# EAGLE design tdt_cableTester (EAGLE 8.1.0)

## Sheet 1 of 4
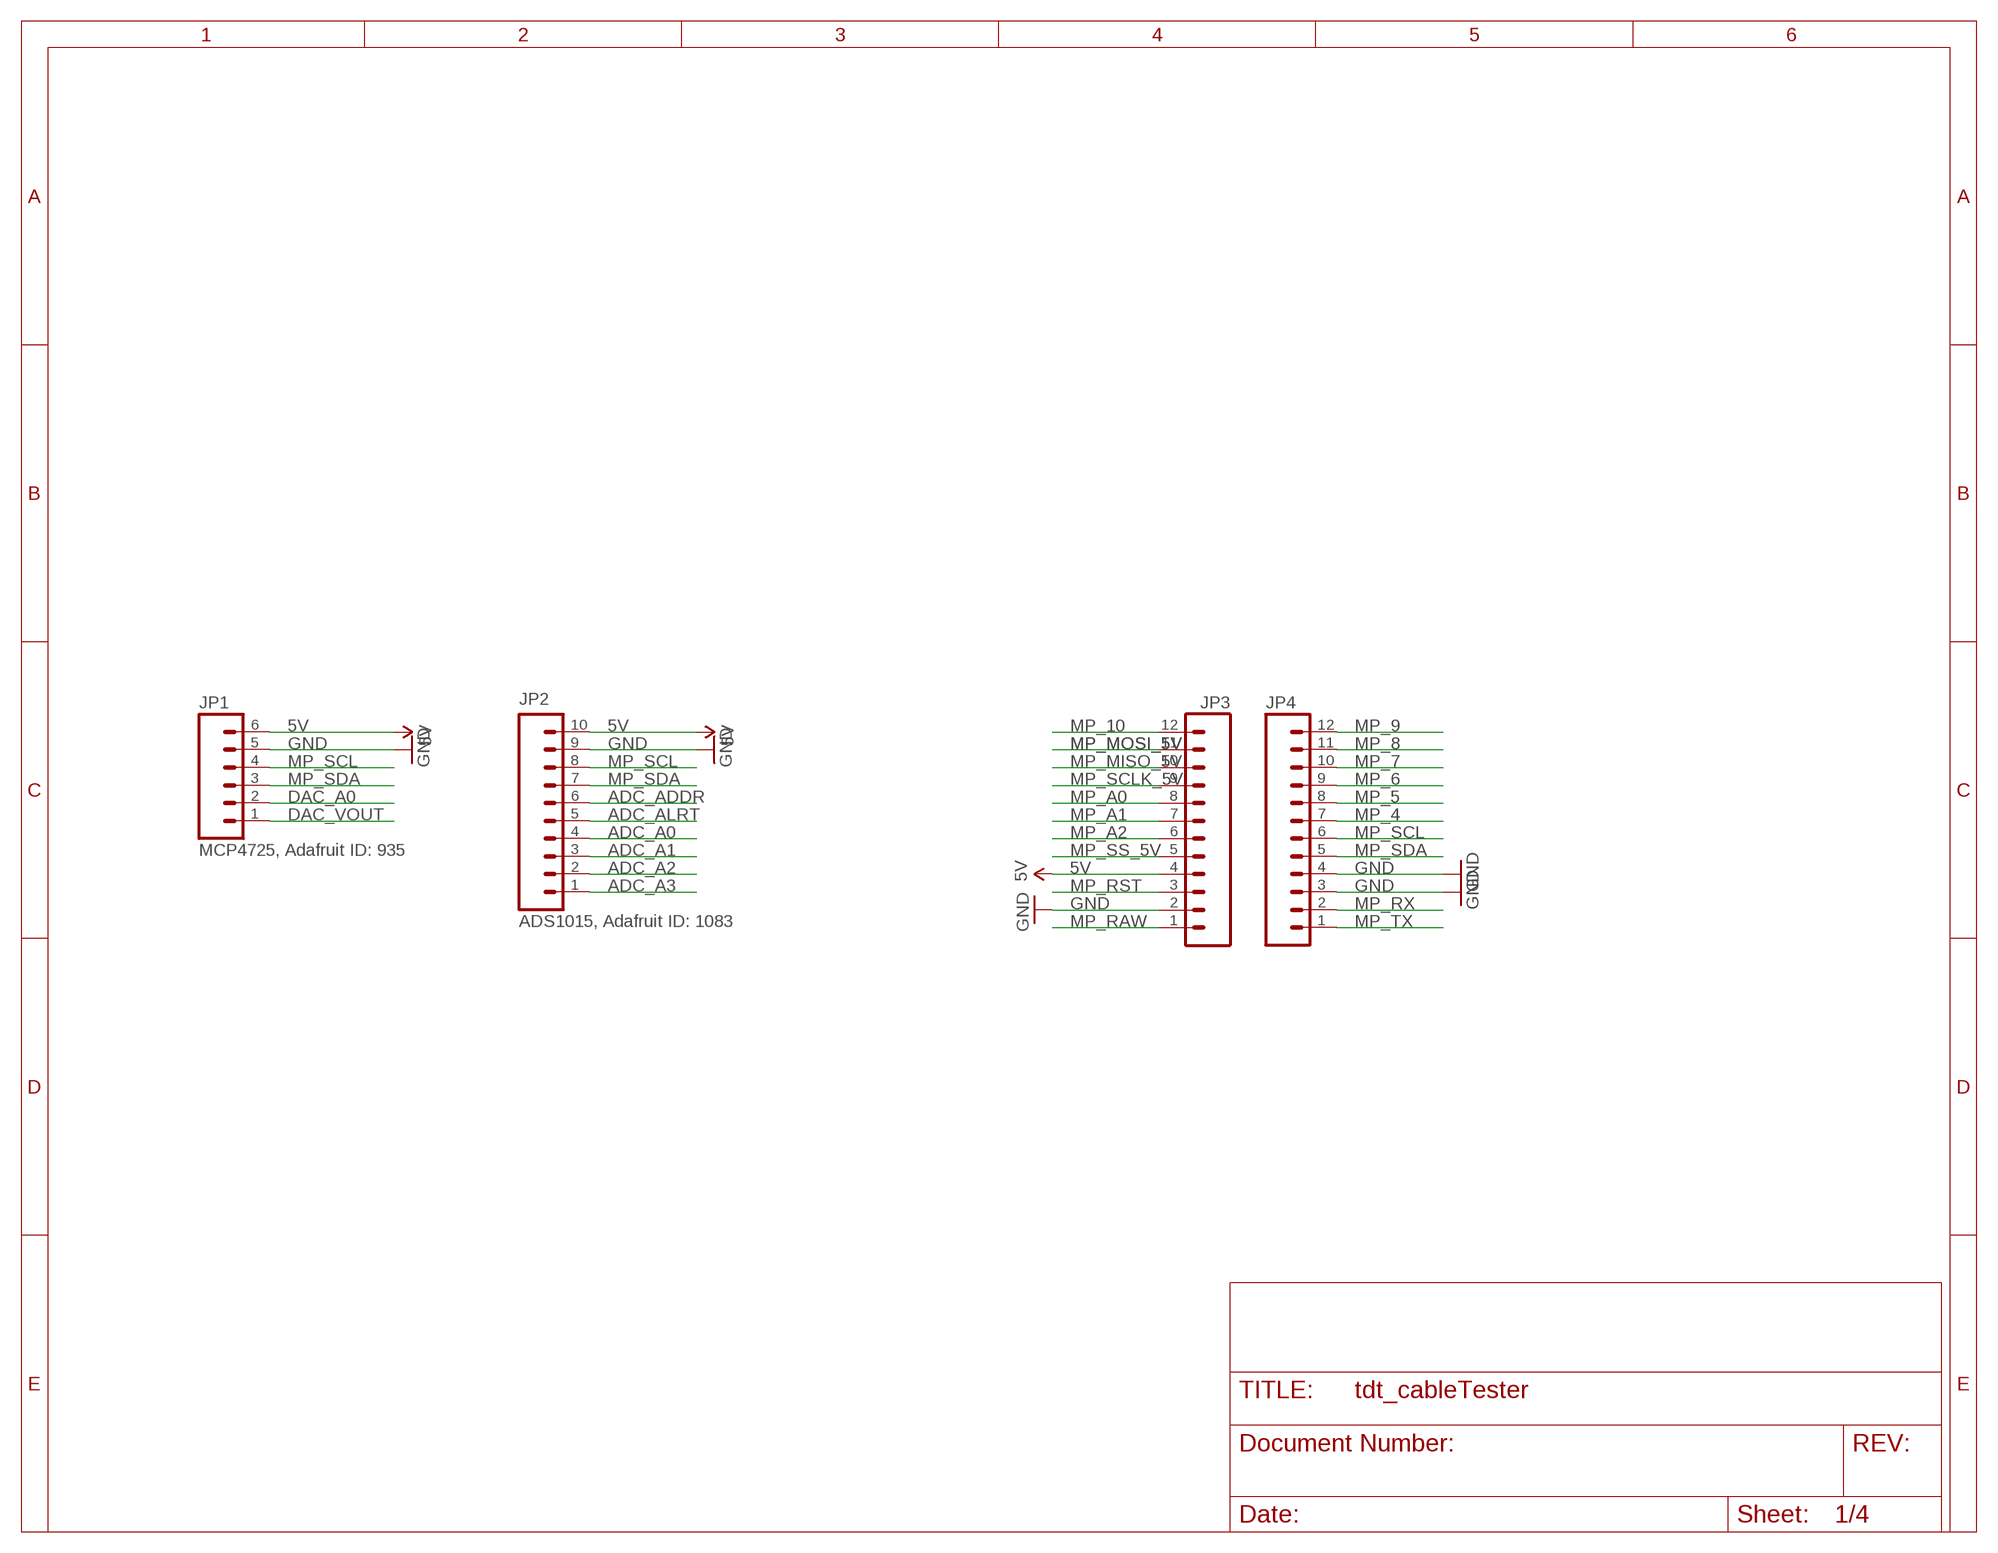
[diagram p0: schematic, sheet 1]

### Parts
JP1  MCP4725, Adafruit ID: 935  M06SILK_FEMALE_PTH  [1X06]
JP2  ADS1015, Adafruit ID: 1083  M10SILK_FEMALE_PTH  [1X10]
JP3  M12PTH  [1X12]
JP4  M12PTH  [1X12]

### Nets
5V: JP1.6 JP2.10 JP3.4 ; also sheet 2,3,4
ADC_A0: JP2.4
ADC_A1: JP2.3 ; also sheet 3
ADC_A2: JP2.2 ; also sheet 3
ADC_A3: JP2.1 ; also sheet 3
ADC_ADDR: JP2.6
ADC_ALRT: JP2.5
DAC_A0: JP1.2
DAC_VOUT: JP1.1 ; also sheet 4
GND: JP1.5 JP2.9 JP3.2 JP4.3 JP4.4 ; also sheet 2,3,4
MP_4: JP4.7 ; also sheet 3
MP_5: JP4.8 ; also sheet 3
MP_6: JP4.9 ; also sheet 3
MP_7: JP4.10 ; also sheet 3
MP_8: JP4.11 ; also sheet 4
MP_9: JP4.12 ; also sheet 4
MP_10: JP3.12 ; also sheet 4
MP_A0: JP3.8 ; also sheet 4
MP_A1: JP3.7 ; also sheet 4
MP_A2: JP3.6 ; also sheet 4
MP_MISO_5V: JP3.10 ; also sheet 2
MP_MOSI_5V: JP3.11 ; also sheet 2
MP_RAW: JP3.1
MP_RST: JP3.3
MP_RX: JP4.2
MP_SCL: JP1.4 JP2.8 JP4.6
MP_SCLK_5V: JP3.9 ; also sheet 2
MP_SDA: JP1.3 JP2.7 JP4.5
MP_SS_5V: JP3.5 ; also sheet 2
MP_TX: JP4.1

## Sheet 2 of 4
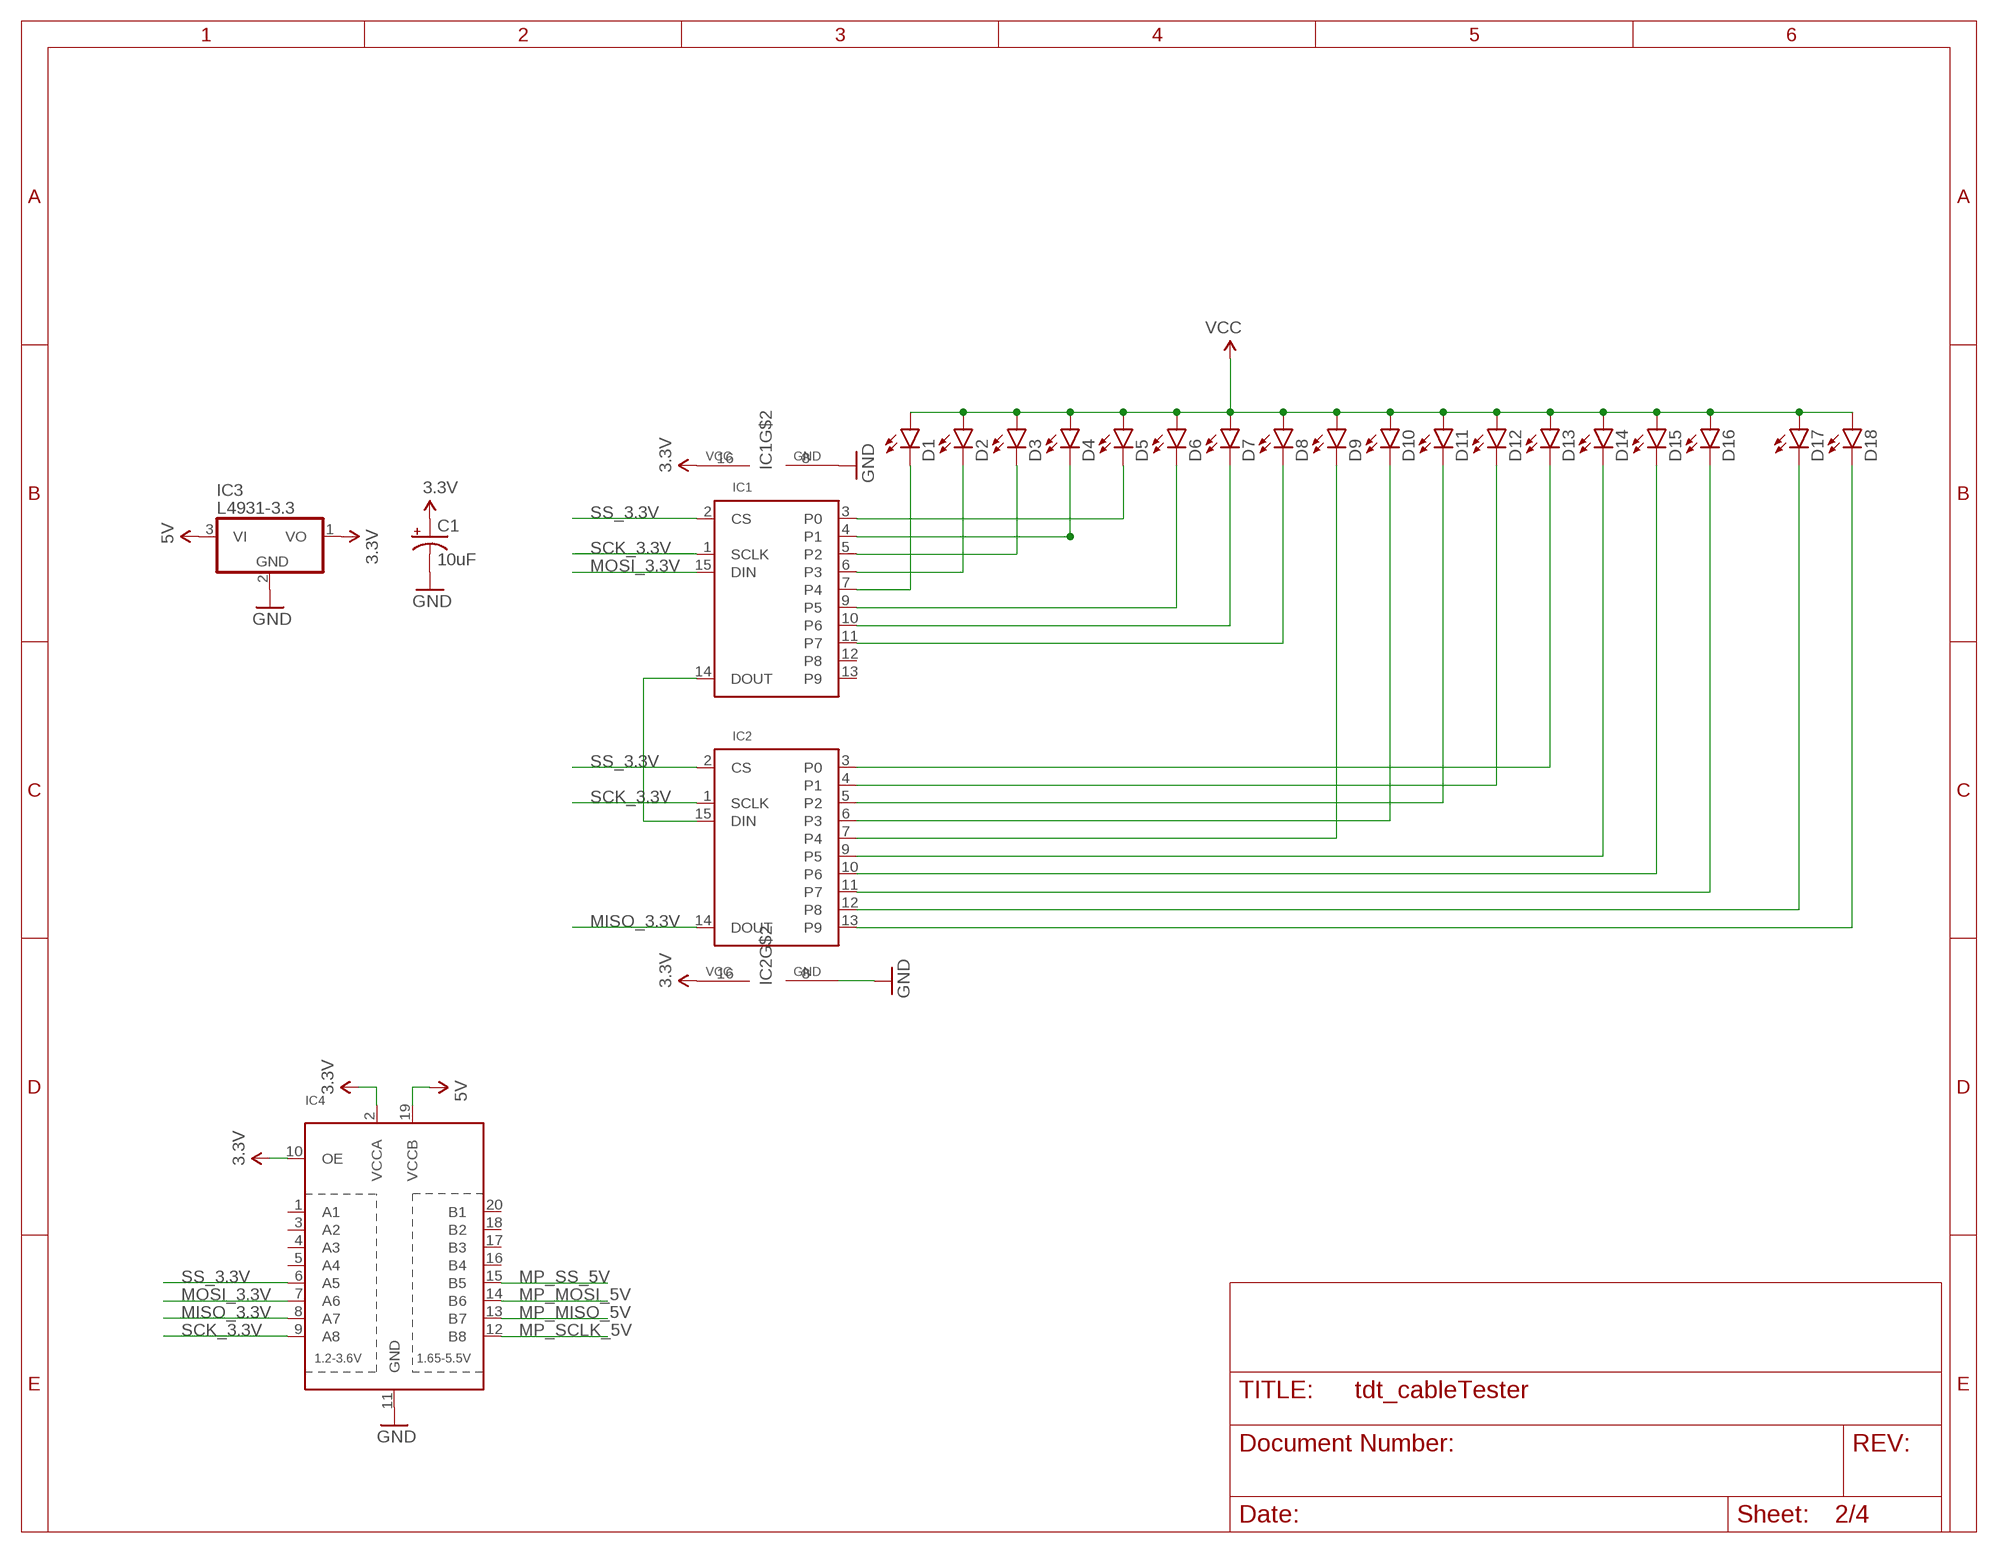
[diagram p1: schematic, sheet 2]

### Parts
C1  10uF  CAP_POLPTH2  [CPOL-RADIAL-10UF-25V]
D1  LED1206  [LED-1206]
D2  LED1206  [LED-1206]
D3  LED1206  [LED-1206]
D4  LED1206  [LED-1206]
D5  LED1206  [LED-1206]
D6  LED1206  [LED-1206]
D7  LED1206  [LED-1206]
D8  LED1206  [LED-1206]
D9  LED1206  [LED-1206]
D10  LED1206  [LED-1206]
D11  LED1206  [LED-1206]
D12  LED1206  [LED-1206]
D13  LED1206  [LED-1206]
D14  LED1206  [LED-1206]
D15  LED1206  [LED-1206]
D16  LED1206  [LED-1206]
D17  LED1206  [LED-1206]
D18  LED1206  [LED-1206]
IC1  MAX6966AEE  [QSOP16]
IC2  MAX6966AEE  [QSOP16]
IC3  L4931-3.3  78L05Z  [TO92]
IC4  TXB0108PWR  [TSSOP20]

### Nets
3.3V: C1.1(+) IC1.16(VCC) IC2.16(VCC) IC3.1(VO) IC4.2(VCCA) IC4.10(OE)
5V: IC3.3(VI) IC4.19(VCCB) ; also sheet 1,3,4
DOUT_3.3V: IC1.14(DOUT) IC2.15(DIN)
GND: C1.2(-) IC1.8(GND) IC2.8(GND) IC3.2(GND) IC4.11(GND) ; also sheet 1,3,4
MISO_3.3V: IC2.14(DOUT) IC4.8(A7)
MOSI_3.3V: IC1.15(DIN) IC4.7(A6)
MP_MISO_5V: IC4.13(B7) ; also sheet 1
MP_MOSI_5V: IC4.14(B6) ; also sheet 1
MP_SCLK_5V: IC4.12(B8) ; also sheet 1
MP_SS_5V: IC4.15(B5) ; also sheet 1
N$1: D9.C IC2.7(P4)
N$2: D10.C IC2.6(P3)
N$3: D11.C IC2.5(P2)
N$5: D12.C IC2.4(P1)
N$6: D13.C IC2.3(P0)
N$7: D14.C IC2.9(P5)
N$9: D5.C IC1.3(P0)
N$11: D3.C IC1.5(P2)
N$12: D2.C IC1.6(P3)
N$13: D1.C IC1.7(P4)
N$14: D6.C IC1.9(P5)
N$15: D7.C IC1.10(P6)
N$16: D8.C IC1.11(P7)
N$19: D4.C IC1.4(P1)
N$23: D16.C IC2.11(P7)
N$25: D18.C IC2.13(P9)
N$27: D15.C IC2.10(P6)
N$29: D17.C IC2.12(P8)
SCK_3.3V: IC1.1(SCLK) IC2.1(SCLK) IC4.9(A8)
SS_3.3V: IC1.2(CS) IC2.2(CS) IC4.6(A5)
VCC: D1.A D2.A D3.A D4.A D5.A D6.A D7.A D8.A D9.A D10.A D11.A D12.A D13.A D14.A D15.A D16.A D17.A D18.A
Unconnected: IC1.12(P8) IC1.13(P9) IC4.1(A1) IC4.3(A2) IC4.4(A3) IC4.5(A4) IC4.16(B4) IC4.17(B3) IC4.18(B2) IC4.20(B1)

## Sheet 3 of 4
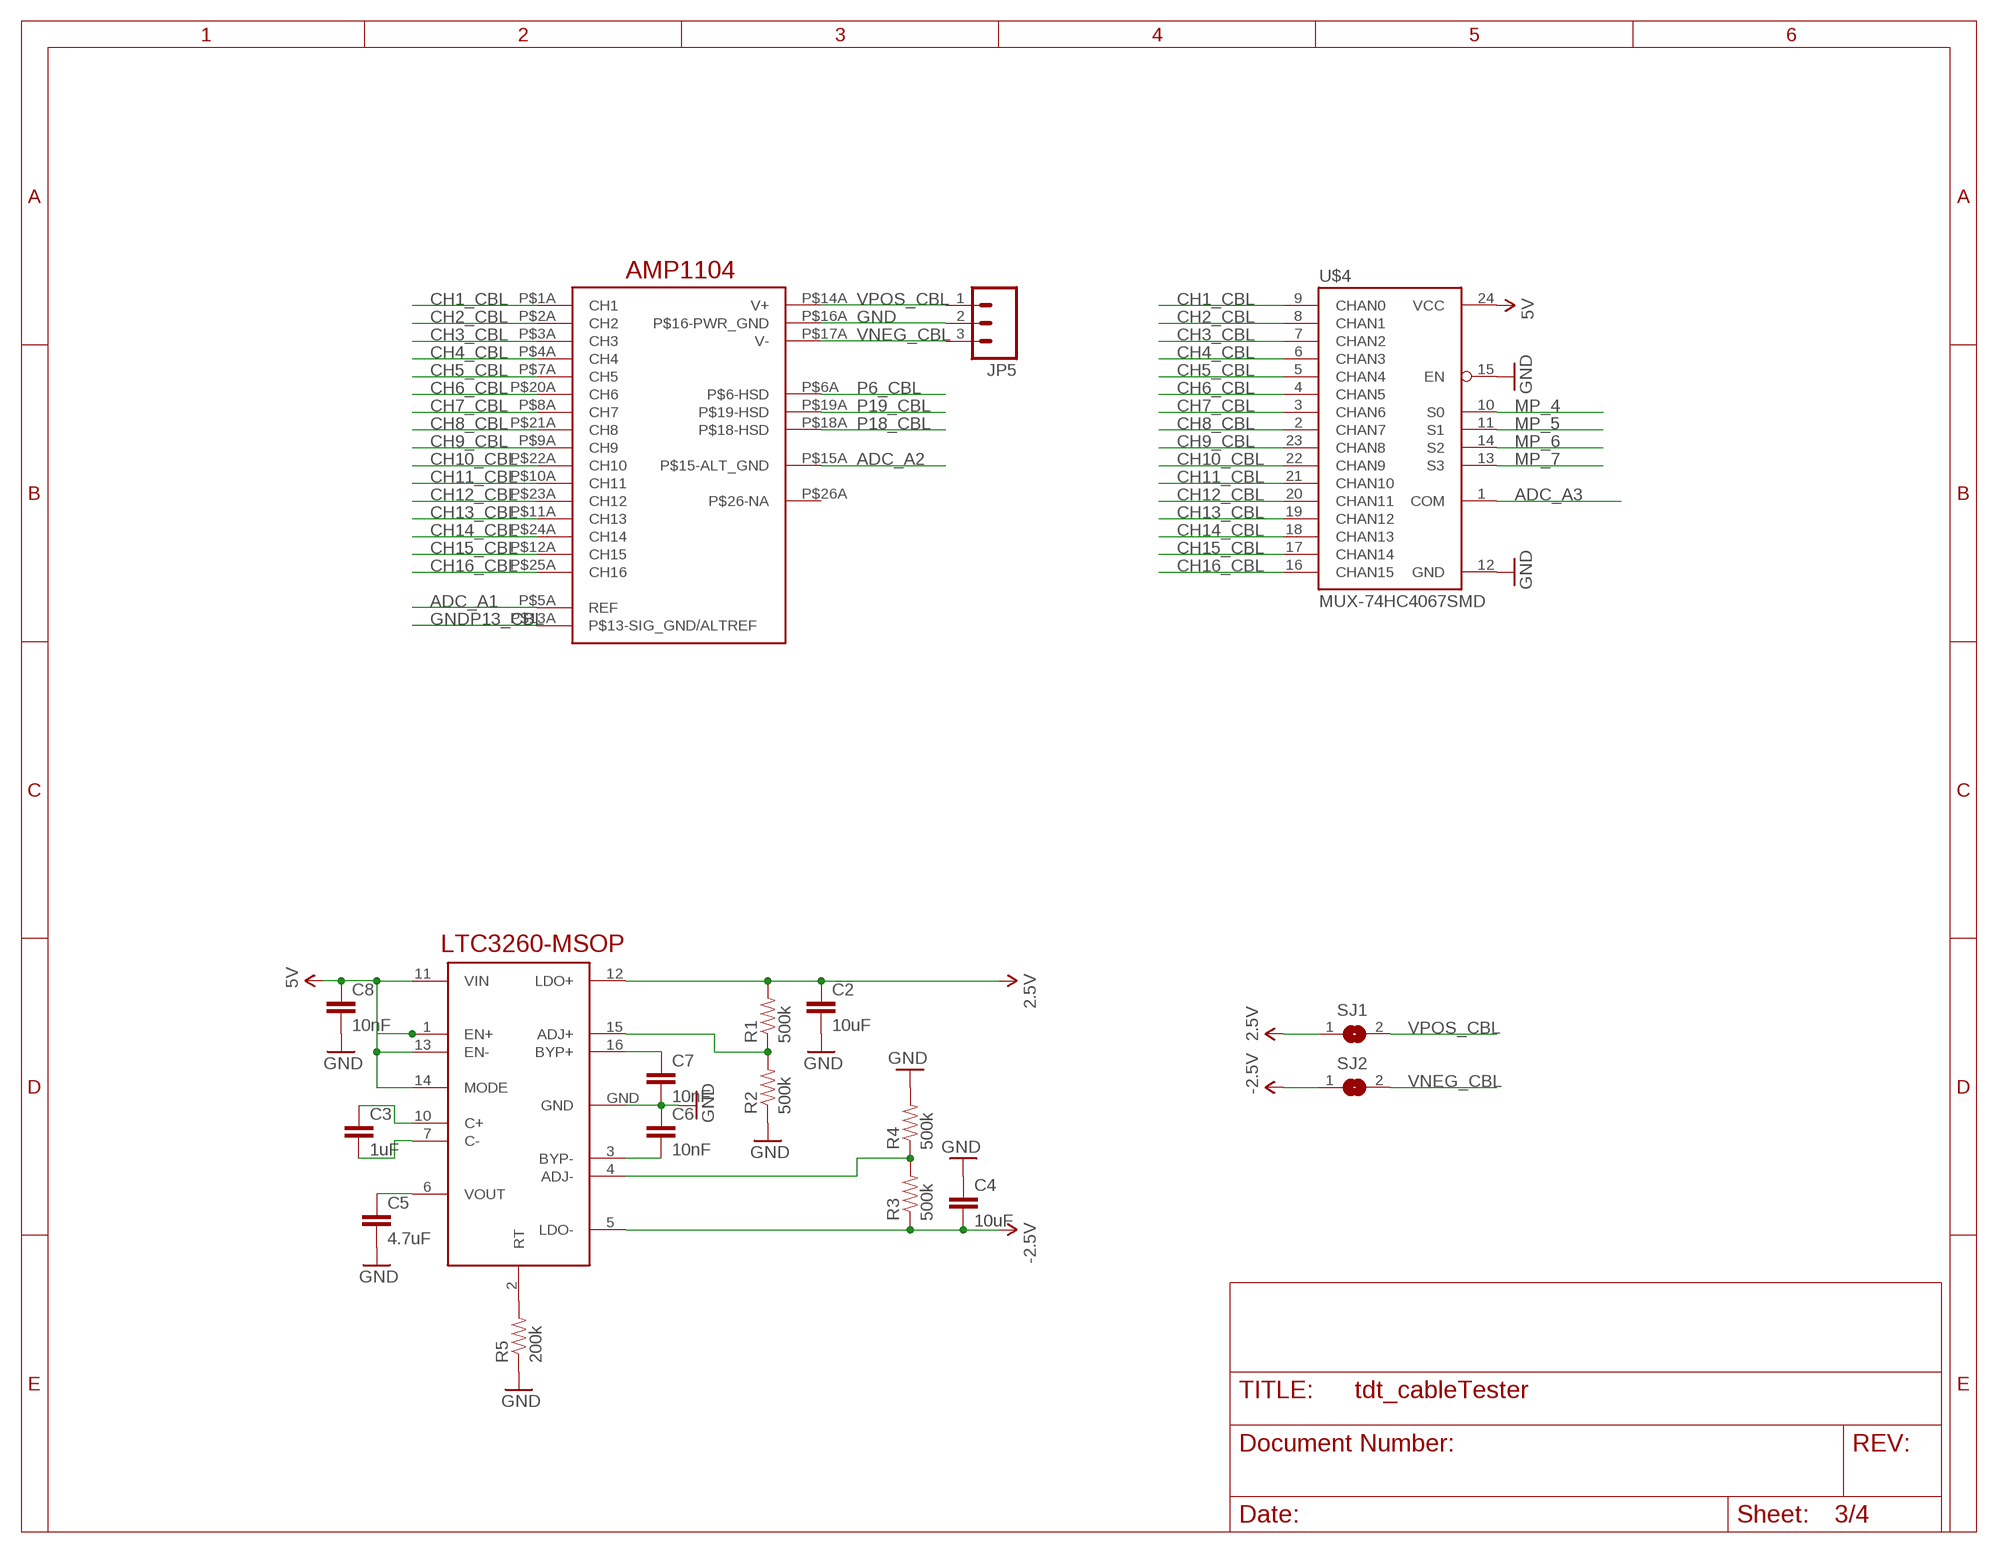
[diagram p2: schematic, sheet 3]

### Parts
C2  10uF  CAP0805  [0805]
C3  1uF  CAP0805  [0805]
C4  10uF  CAP0805  [0805]
C5  4.7uF  CAP0805  [0805]
C6  10nF  CAP0805  [0805]
C7  10nF  CAP0805  [0805]
C8  10nF  CAP0805  [0805]
JP5  M03PTH  [1X03]
R1  500k  RESISTOR0805-RES  [0805]
R2  500k  RESISTOR0805-RES  [0805]
R3  500k  RESISTOR0805-RES  [0805]
R4  500k  RESISTOR0805-RES  [0805]
R5  200k  RESISTOR0805-RES  [0805]
SJ1  SJ  [SJ]
SJ2  SJ  [SJ]
U$3  AMP1104  [AMP1104]
U$4  MUX-74HC4067SMD  [SSOP24]
U$7  LTC3260-MSOP  [MSOP16]

### Nets
2.5V: C2.1 R1.2 SJ1.1 U$7.12(LDO+)
5V: C8.1 U$4.24(VCC) U$7.1(EN+) U$7.11(VIN) U$7.13(EN-) U$7.14(MODE) ; also sheet 1,2,4
-2.5V: C4.2 R3.1 SJ2.1 U$7.5(LDO-)
ADC_A1: U$3.P$5A(REF) ; also sheet 1
ADC_A2: U$3.P$15A(P$15-ALT_GND) ; also sheet 1
ADC_A3: U$4.1(COM) ; also sheet 1
CH1_CBL: U$3.P$1A(CH1) U$4.9(CHAN0)
CH2_CBL: U$3.P$2A(CH2) U$4.8(CHAN1)
CH3_CBL: U$3.P$3A(CH3) U$4.7(CHAN2)
CH4_CBL: U$3.P$4A(CH4) U$4.6(CHAN3)
CH5_CBL: U$3.P$7A(CH5) U$4.5(CHAN4)
CH6_CBL: U$3.P$20A(CH6) U$4.4(CHAN5)
CH7_CBL: U$3.P$8A(CH7) U$4.3(CHAN6)
CH8_CBL: U$3.P$21A(CH8) U$4.2(CHAN7)
CH9_CBL: U$3.P$9A(CH9) U$4.23(CHAN8)
CH10_CBL: U$3.P$22A(CH10) U$4.22(CHAN9)
CH11_CBL: U$3.P$10A(CH11) U$4.21(CHAN10)
CH12_CBL: U$3.P$23A(CH12) U$4.20(CHAN11)
CH13_CBL: U$3.P$11A(CH13) U$4.19(CHAN12)
CH14_CBL: U$3.P$24A(CH14) U$4.18(CHAN13)
CH15_CBL: U$3.P$12A(CH15) U$4.17(CHAN14)
CH16_CBL: U$3.P$25A(CH16) U$4.16(CHAN15)
GND: C2.2 C4.1 C5.2 C6.1 C7.2 C8.2 JP5.2 R2.1 R4.2 R5.1 U$3.P$16A(P$16-PWR_GND) U$4.12(GND) U$4.15(EN) U$7.GND ; also sheet 1,2,4
GNDP13_CBL: U$3.P$13A(P$13-SIG_GND/ALTREF)
MP_4: U$4.10(S0) ; also sheet 1
MP_5: U$4.11(S1) ; also sheet 1
MP_6: U$4.14(S2) ; also sheet 1
MP_7: U$4.13(S3) ; also sheet 1
N$4: R1.1 R2.2 U$7.15(ADJ+)
N$8: C6.2 U$7.3(BYP-)
N$10: R5.2 U$7.2(RT)
N$17: C7.1 U$7.16(BYP+)
N$18: R3.2 R4.1 U$7.4(ADJ-)
N$20: C3.1 U$7.10(C+)
N$21: C3.2 U$7.7(C-)
N$22: C5.1 U$7.6(VOUT)
P6_CBL: U$3.P$6A(P$6-HSD)
P18_CBL: U$3.P$18A(P$18-HSD)
P19_CBL: U$3.P$19A(P$19-HSD)
VNEG_CBL: JP5.3 SJ2.2 U$3.P$17A(V-)
VPOS_CBL: JP5.1 SJ1.2 U$3.P$14A(V+)
Unconnected: U$3.P$26A(P$26-NA)

## Sheet 4 of 4
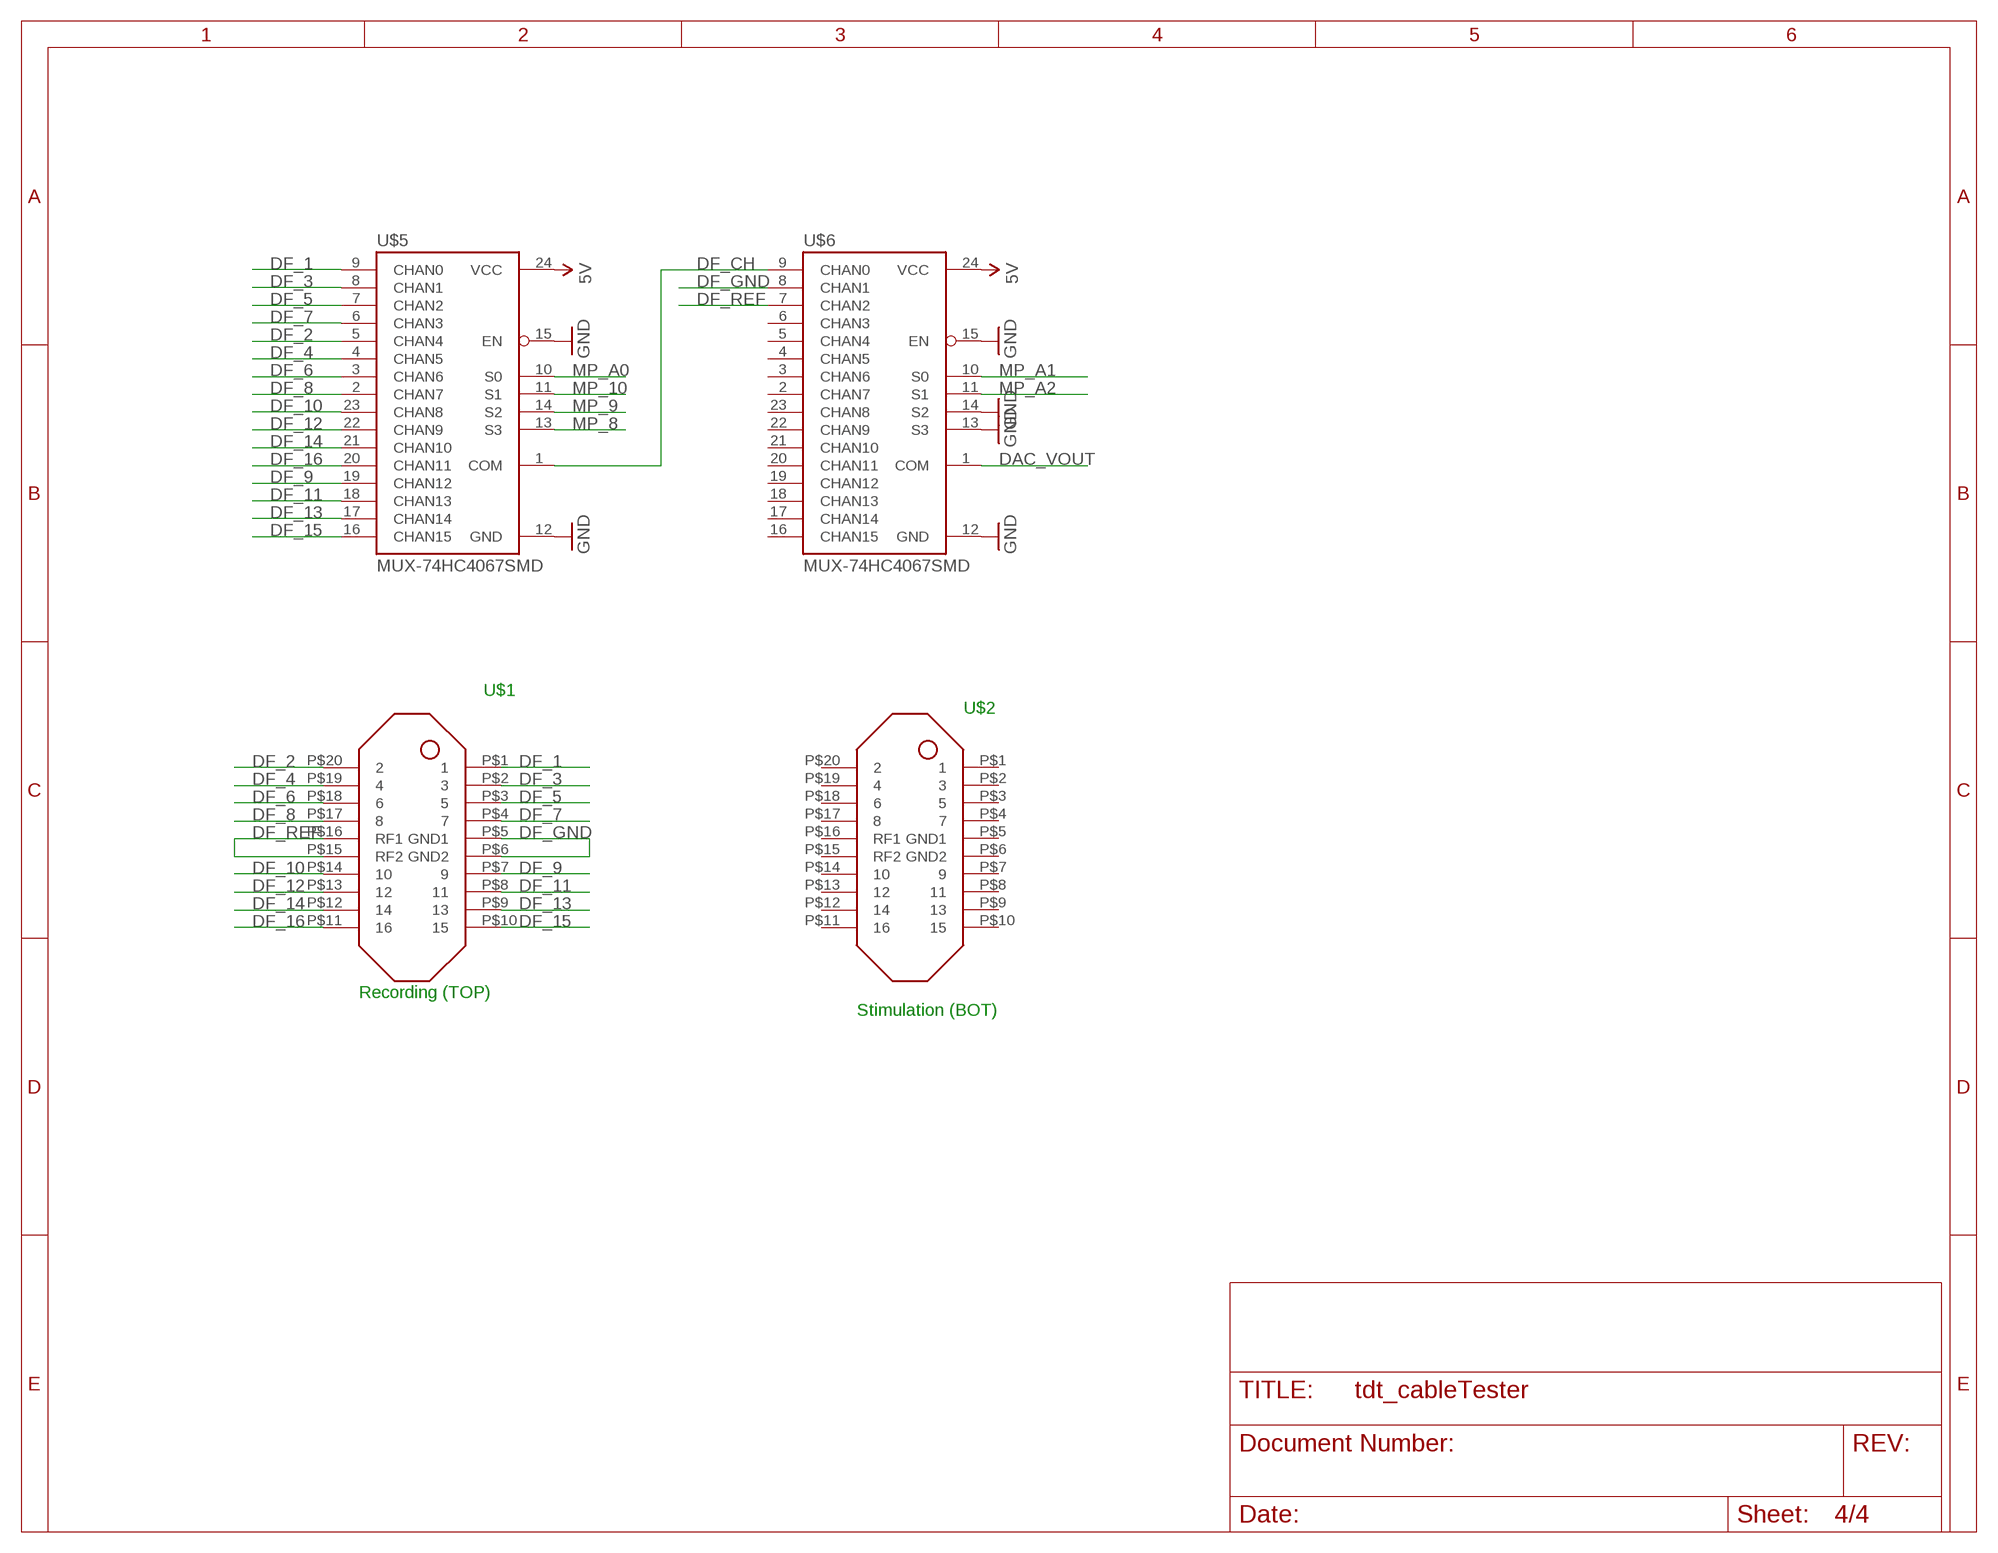
[diagram p3: schematic, sheet 4]

### Parts
U$1  DF30_HEADER  [DF30FC-20DP-0.4V]
U$2  DF30_HEADER  [DF30FC-20DP-0.4V]
U$5  MUX-74HC4067SMD  [SSOP24]
U$6  MUX-74HC4067SMD  [SSOP24]

### Nets
5V: U$5.24(VCC) U$6.24(VCC) ; also sheet 1,2,3
DAC_VOUT: U$6.1(COM) ; also sheet 1
DF_1: U$1.P$1 U$5.9(CHAN0)
DF_2: U$1.P$20 U$5.5(CHAN4)
DF_3: U$1.P$2 U$5.8(CHAN1)
DF_4: U$1.P$19 U$5.4(CHAN5)
DF_5: U$1.P$3 U$5.7(CHAN2)
DF_6: U$1.P$18 U$5.3(CHAN6)
DF_7: U$1.P$4 U$5.6(CHAN3)
DF_8: U$1.P$17 U$5.2(CHAN7)
DF_9: U$1.P$7 U$5.19(CHAN12)
DF_10: U$1.P$14 U$5.23(CHAN8)
DF_11: U$1.P$8 U$5.18(CHAN13)
DF_12: U$1.P$13 U$5.22(CHAN9)
DF_13: U$1.P$9 U$5.17(CHAN14)
DF_14: U$1.P$12 U$5.21(CHAN10)
DF_15: U$1.P$10 U$5.16(CHAN15)
DF_16: U$1.P$11 U$5.20(CHAN11)
DF_CH: U$5.1(COM) U$6.9(CHAN0)
DF_GND: U$1.P$5(GND1) U$1.P$6(GND2) U$6.8(CHAN1)
DF_REF: U$1.P$15(RF2) U$1.P$16(RF1) U$6.7(CHAN2)
GND: U$5.12(GND) U$5.15(EN) U$6.12(GND) U$6.13(S3) U$6.14(S2) U$6.15(EN) ; also sheet 1,2,3
MP_8: U$5.13(S3) ; also sheet 1
MP_9: U$5.14(S2) ; also sheet 1
MP_10: U$5.11(S1) ; also sheet 1
MP_A0: U$5.10(S0) ; also sheet 1
MP_A1: U$6.10(S0) ; also sheet 1
MP_A2: U$6.11(S1) ; also sheet 1
Unconnected: U$2.P$1 U$2.P$2 U$2.P$3 U$2.P$4 U$2.P$5(GND1) U$2.P$6(GND2) U$2.P$7 U$2.P$8 U$2.P$9 U$2.P$10 U$2.P$11 U$2.P$12 U$2.P$13 U$2.P$14 U$2.P$15(RF2) U$2.P$16(RF1) U$2.P$17 U$2.P$18 U$2.P$19 U$2.P$20 U$6.2(CHAN7) U$6.3(CHAN6) U$6.4(CHAN5) U$6.5(CHAN4) U$6.6(CHAN3) U$6.16(CHAN15) U$6.17(CHAN14) U$6.18(CHAN13) U$6.19(CHAN12) U$6.20(CHAN11) U$6.21(CHAN10) U$6.22(CHAN9) U$6.23(CHAN8)

### Notes on the sheet
- U$1
- U$2
- Recording (TOP)
- Stimulation (BOT)

## Library data of the parts
C1 = SparkFun-Capacitors:CAP_POL: Capacitor Polarized These are standard SMD and PTH capacitors. Normally 10uF, 47uF, and 100uF in electrolytic and tantalum varieties. Always verify the external diameter of the through hole cap, it varies with capacity, voltage, and manufacturer. The EIA devices should be standard.
C2-C8 = SparkFun-Capacitors:CAP: Capacitor Standard 0603 ceramic capacitor, and 0.1" leaded capacitor.
D1-D18 = SparkFun-LED:LED: LEDs Standard schematic elements and footprints for 5mm, 3mm, 1206, and 0603 sized LEDs. 5mm - Spark Fun Electronics SKU : COM-00529 (and others)
IC1 IC2 = max696x:MAX6966AEE
IC3 = adafruit:78*: Positive VOLTAGE REGULATOR Added bigger pads to the TO-92 package
IC4 = adafruit:TXB0108PWR: 8-Bit Bi-Directional Level Shifter 1.2V-3.6V (VCCA) to 1.65V-5.5V (VCCB) bi-directional level shifter with auto direction sensing. Max data rate - VCCA 1.8V: 20Mbps (50ns), VCCA 3.3V: 100Mbps (10ns) Digikey: 296-21527-1-ND
JP1 = SparkFun-Connectors:M06: Header 6 Standard 6-pin 0.1" header. Use with straight break away headers (SKU : PRT-00116), right angle break away headers (PRT-00553), swiss pins (PRT-00743), machine pins (PRT-00117), and female headers (PRT-00115). Molex polarized connector foot print use with SKU : PRT-08094 with associated crimp pins and housings. NOTES ON THE VARIANTS LOCK and LOCK_LONGPADS... This footprint was designed to help hold the alignment of a through-hole component (i.e. 6-pin header) while soldering it into place. You may notice that each hole has been shifted either up or down by 0.005 of an inch from it's more standard position (which is a perfectly straight line). This slight alteration caused the pins (the squares in the middle) to touch the edges of the holes. Because they are alternating, it causes a "brace" to hold the component in place. 0.005 has proven to be the perfect amount of "off-center" position when using our standard breakaway headers. Although looks a little odd when you look at the bare footprint, once you have a header in there, the alteration is very hard to notice. Also,if you push a header all the way into place, it is covered up entirely on the bottom side. This idea of altering the position of holes to aid alignment will be further integrated into the Sparkfun Library for other footprints. It can help hold any component with 3 or more connection pins.; PROD_ID: CONN-08437
JP2 = SparkFun-Connectors:M10: Header 10 Standard 10-pin 0.1" header. Use with straight break away headers (SKU : PRT-00116), right angle break away headers (PRT-00553), swiss pins (PRT-00743), machine pins (PRT-00117), and female headers (PRT-00115).; PROD_ID: CONN-11563
JP3 JP4 = SparkFun-Connectors:M12: Header 12 Standard 12-pin 0.1" header. Use with straight break away headers (SKU : PRT-00116), right angle break away headers (PRT-00553), swiss pins (PRT-00743), machine pins (PRT-00117), and female headers (PRT-00115).
JP5 = SparkFun-Connectors:M03: Header 3 Standard 3-pin 0.1" header. Use with straight break away headers (SKU : PRT-00116), right angle break away headers (PRT-00553), swiss pins (PRT-00743), machine pins (PRT-00117), and female headers (PRT-00115). Molex polarized connector foot print use with SKU : PRT-08232 with associated crimp pins and housings.
R1-R5 = SparkFun-Resistors:RESISTOR: Resistor Basic schematic elements and footprints for 0603, 1206, and PTH resistors.
SJ1 SJ2 = jumper:SJ: SMD solder JUMPER
U$1 U$2 = TDT_Connectors:DF30_HEADER
U$3 = TDTCableConnector:AMP1104
U$4-U$6 = SparkFun-AnalogIC:MUX-74HC4067: 16-channel analog MUX
U$7 = LTC3260:LTC3260-MSOP

## Board
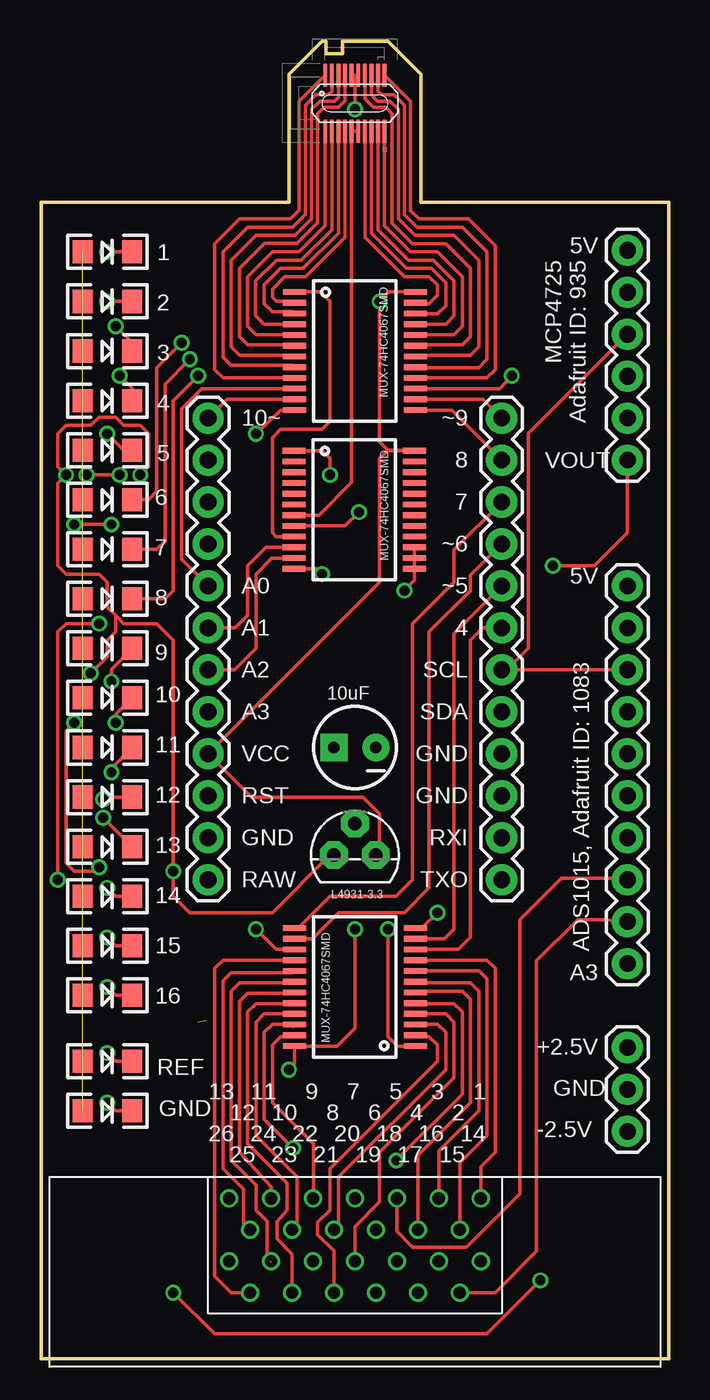
[diagram p4: board, top side]
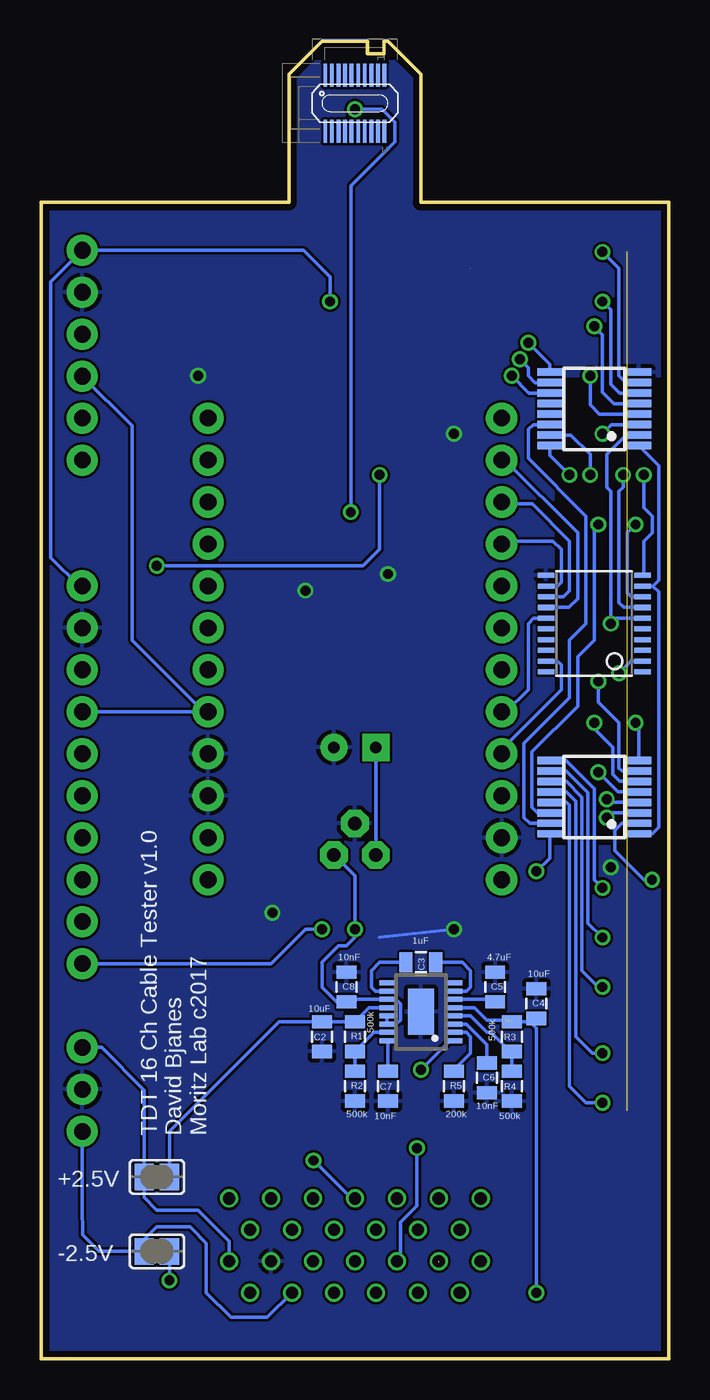
[diagram p5: board, bottom side, seen from below]

Size 38 x 79.75 mm. Coordinates in mm from the lower left corner, seen from the top.
Outline: 0,70 0,0 38,0 38,70 23,70 23,77.75 21,79.75 18.25,79.75 18.25,79 17.25,79 17.25,79.75 17,79.75 15,77.75 15,70 0,70
Copper layers (1*16): Top 0.0356mm / dielectric 1.5011mm / Bottom 0.0356mm
Design rules "oshpark-2layer *": minimum track width 6mil, minimum drill 13mil, track to track 6mil, track to pad 6mil, pad to pad 6mil, via to via 6mil, smd to smd 6mil, copper to edge 15mil, drill to drill 6mil, minimum pad ring 7mil, minimum via ring 7mil, stop-mask expansion 2.5mil, vias tented up to drill 0mil, thermal gap 10mil

### Footprints (pad centres in the part's own frame; a part is rotated, then mirrored left to right if it is on the bottom)
CPOL-RADIAL-10UF-25V = drill 0.7 pad 1.651 square: 1 1.27,0 | drill 0.7 pad 1.651: 2 -1.27,0
0805 = smd 0.8 x 1.2: 1 -0.9,0; 2 0.9,0
LED-1206 = smd 1.2 x 1.4: A -1.5,0; C 1.5,0
QSOP16 = smd 0.45 x 1.5: 1 -2.223,-2.69; 2 -1.587,-2.69; 3 -0.953,-2.69; 4 -0.318,-2.69; 5 0.318,-2.69; 6 0.953,-2.69; 7 1.587,-2.69; 8 2.223,-2.69; 9 2.223,2.69; 10 1.587,2.69; 11 0.953,2.69; 12 0.318,2.69; 13 -0.318,2.69; 14 -0.953,2.69; 15 -1.587,2.69; 16 -2.223,2.69
TO92 = drill 0.813 pad 1.676 octagon: 1 -1.27,0; 2 0,1.905; 3 1.27,0
TSSOP20 = smd 0.305 x 0.991: 1 -2.925,-2.918; 2 -2.275,-2.918; 3 -1.625,-2.918; 4 -0.975,-2.918; 5 -0.325,-2.918; 6 0.325,-2.918; 7 0.975,-2.918; 8 1.625,-2.918; 9 2.275,-2.918; 10 2.925,-2.918; 11 2.925,2.918; 12 2.275,2.918; 13 1.625,2.918; 14 0.975,2.918; 15 0.325,2.918; 16 -0.325,2.918; 17 -0.975,2.918; 18 -1.625,2.918; 19 -2.275,2.918; 20 -2.925,2.918
1X06 = drill 1.016 pad 1.88: 1 0,0; 2 2.54,0; 3 5.08,0; 4 7.62,0; 5 10.16,0; 6 12.7,0
1X10 = drill 1.016 pad 1.88: 1 0,0; 2 2.54,0; 3 5.08,0; 4 7.62,0; 5 10.16,0; 6 12.7,0; 7 15.24,0; 8 17.78,0; 9 20.32,0; 10 22.86,0
1X12 = drill 1.016 pad 1.88: 1 0,0; 2 2.54,0; 3 5.08,0; 4 7.62,0; 5 10.16,0; 6 12.7,0; 7 15.24,0; 8 17.78,0; 9 20.32,0; 10 22.86,0; 11 25.4,0; 12 27.94,0
1X03 = drill 1.016 pad 1.88: 1 0,0; 2 2.54,0; 3 5.08,0
SJ = smd 1.168 x 1.6: 1 -0.762,0; 2 0.762,0
DF30FC-20DP-0.4V = smd 0.23 x 1.4: P$1 -1.8,1.7; P$2 -1.4,1.7; P$3 -1,1.7; P$4 -0.6,1.7; P$5 -0.2,1.7; P$6 0.2,1.7; P$7 0.6,1.7; P$8 1,1.7; P$9 1.4,1.7; P$10 1.8,1.7; P$11 1.8,-1.7; P$12 1.4,-1.7; P$13 1,-1.7; P$14 0.6,-1.7; P$15 0.2,-1.7; P$16 -0.2,-1.7; P$17 -0.6,-1.7; P$18 -1,-1.7; P$19 -1.4,-1.7; P$20 -1.8,-1.7
AMP1104 = drill 0.737 pad 1.092: P$1A -7.62,-5.7; P$2A -6.35,-3.8; P$3A -5.08,-5.7; P$4A -3.81,-3.8; P$5A -2.54,-5.7; P$6A -1.27,-3.8; P$7A 0,-5.7; P$8A 1.27,-3.8; P$9A 2.54,-5.7; P$10A 3.81,-3.8; P$11A 5.08,-5.7; P$12A 6.35,-3.8; P$13A 7.62,-5.7; P$14A -7.62,-1.9; P$15A -6.35,0; P$16A -5.08,-1.9; P$17A -3.81,0; P$18A -2.54,-1.9; P$19A -1.27,0; P$20A 0,-1.9; P$21A 1.27,0; P$22A 2.54,-1.9; P$23A 3.81,0; P$24A 5.08,-1.9; P$25A 6.35,0; P$26A 7.62,-1.9
SSOP24 = smd 0.348 x 1.397: 1 -3.575,-3.656; 2 -2.925,-3.656; 3 -2.275,-3.656; 4 -1.625,-3.656; 5 -0.975,-3.656; 6 -0.325,-3.656; 7 0.325,-3.656; 8 0.975,-3.656; 9 1.625,-3.656; 10 2.275,-3.656; 11 2.925,-3.656; 12 3.575,-3.656; 13 3.575,3.656; 14 2.925,3.656; 15 2.275,3.656; 16 1.625,3.656; 17 0.975,3.656; 18 0.325,3.656; 19 -0.325,3.656; 20 -0.975,3.656; 21 -1.625,3.656; 22 -2.275,3.656; 23 -2.925,3.656; 24 -3.575,3.656
MSOP16 = smd 0.3 x 0.9: 1 -1.75,-2.05; 2 -1.25,-2.05; 3 -0.75,-2.05; 4 -0.25,-2.05; 5 0.25,-2.05; 6 0.75,-2.05; 7 1.25,-2.05; 8 1.75,-2.05; 9 1.75,2.05; 10 1.25,2.05; 11 0.75,2.05; 12 0.25,2.05; 13 -0.25,2.05; 14 -0.75,2.05; 15 -1.25,2.05; 16 -1.75,2.05 | smd 2.8 x 1.6: GND 0,0

### Placement (x,y rotation side)
C1  19,37 180 top
C2  21,19.5 270 bottom
C3  15,24 0 bottom
C4  8,21.5 270 bottom
C5  10.5,22.5 90 bottom
C6  11,17 90 bottom
C7  17,16.5 270 bottom
C8  19.5,22.5 90 bottom
D1  4,67 0 top
D2  4,64 0 top
D3  4,61 0 top
D4  4,58 0 top
D5  4,55 0 top
D6  4,52 0 top
D7  4,49 0 top
D8  4,46 0 top
D9  4,43 0 top
D10  4,40 0 top
D11  4,37 0 top
D12  4,34 0 top
D13  4,31 0 top
D14  4,28 0 top
D15  4,25 0 top
D16  4,22 0 top
D17  4,18 0 top
D18  4,15 0 top
IC1  4.5,57.5 90 bottom
IC2  4.5,34 90 bottom
IC3  19,30.5 0 top
IC4  4.5,44.5 90 bottom
JP1  35.51,54.4 90 top
JP2  35.51,23.92 90 top
JP3  10.11,29 90 top
JP4  27.89,29 90 top
JP5  35.51,18.84 270 top
R1  19,19.5 90 bottom
R2  19,16.5 90 bottom
R3  9.5,19.5 270 bottom
R4  9.5,16.5 270 bottom
R5  13,16.5 90 bottom
SJ1  31,11 180 bottom
SJ2  31,6.5 180 bottom
U$1  19,76 0 top
U$2  19,76 0 bottom
U$3  19,4 180 top
U$4  19,22.5 90 top
U$5  19,61 270 top
U$6  18.96,51.39 270 top
U$7  15,21 90 bottom

### Tracks (layer width: path | path; a pad name or v marks a point on that pad's centre or on a via)
2.5V
  Bottom 0.203: U$7.12 18.15,21.25 R1.2 C2.1 23.6,20.4 30.24,13.76 SJ1.1
3.3V  (via drill 0.6)
  Top 0.203: v6,53.5 6.5,54 6.5,56 6,56.5 5,56.5 4.5,57 3.5,57 3,56.5 1.5,56.5 1,56 1,54 v1.5,53.5 1,53 1,48 1.5,47.5 3.5,47.5 4,47 4,45.5 4.5,45 | v3,41.5 4,42.5 4,43.5 4.5,44 4.5,45 | 4.5,45 5,44.5 7,44.5 8,43.5 v8,29.5 8,28 9,27 14,27 17.5,30.5 IC3.1
  Bottom 0.203: IC1.16 7.19,54.69 v6,53.5 | IC4.10 1.5,47.5 1.5,49.5 1,50 1,51 1.5,51.5 v1.5,53.5 | IC4.2 2.27,42.23 v3,41.5 | v8,29.5 7.19,30.31 IC2.16 | C1.1 IC3.1
5V  (via drill 0.6)
  Top 0.203: IC3.3 20.27,30.52 20.5,30.75 20.5,33 19.5,34 12.73,34 JP3.4 20.5,47.01 20.5,54.5 20.96,54.97 U$6.24 22.58,55 21,55 20.5,55.5 v20.5,64 21.07,64.58 U$5.24 | v19,26 19,20 17.93,18.93 U$4.24 15.34,17.84 v15,17.5
  Bottom 0.203: IC4.19 6.72,42.23 6.5,42 6.5,40.5 10.11,36.89 JP3.4 | IC3.3 19,29.23 v19,26 19,25.5 19.5,25 20,25 21,24 21,22.5 20.1,21.6 C8.1 19.35,21.75 U$7.11 16.5,21.75 16.25,21.5 16.25,20.5 16.5,20.25 U$7.14 U$7.13 | v20.5,64 20.5,65.5 22.1,67.1 JP1.6 37.42,65.19 37.42,48.5 35.7,46.78 JP2.10 | U$7.1 13.25,19.25 v15,17.5
-2.5V  (via drill 0.6)  (1 unrouted)
  Top 0.203: v8,4 10.5,1.5 27,1.5 v30.24,4.74
  Bottom 0.203: U$7.5 11.75,21.25 11,20.5 10,20.5 | C4.2 8.2,20.4 8.4,20.4 | 8.4,20.4 R3.1 | 8.4,20.4 8,20 v8,4 | v30.24,4.74 SJ2.1
ADC_A1
  Top 0.203: U$3.P$5A 21.54,7.71 22.5,6.75 25.75,6.75 29,10 29,26.58 31.5,29.08 35.43,29.08 JP2.3
ADC_A2
  Top 0.203: U$3.P$15A 27.5,4 30,6.5 30,24.08 32.5,26.58 34.12,26.58 JP2.2
ADC_A3  (via drill 0.6)
  Top 0.203: U$4.1 21.57,18.93 21,19.5 v21,26
  Bottom 0.203: v21,26 22,26 24.08,23.92 JP2.1
CH1_CBL
  Top 0.203: U$3.P$1A 26.62,11.62 27.5,12.5 27.5,23.62 27,24.12 U$4.9
CH2_CBL
  Top 0.203: U$3.P$2A 25.35,11.85 27,13.5 27,23 26.5,23.5 22.68,23.5 U$4.8
CH3_CBL
  Top 0.203: U$3.P$3A 24.08,12.58 26.5,15 26.5,22.25 26,22.75 22.73,22.75 U$4.7
CH4_CBL
  Top 0.203: U$3.P$4A 22.81,12.31 26,15.5 26,21.75 25.5,22.25 22.73,22.25 U$4.6
CH5_CBL  (via drill 0.6)
  Top 0.203: v21.5,12 25.5,16 25.5,21 25,21.5 22.68,21.5 U$4.5
  Bottom 0.203: U$3.P$7A 19.2,9.7 v21.5,12
CH6_CBL
  Top 0.203: U$3.P$20A 19,8 20.5,9.5 20.5,12.5 25,17 25,20.38 24.5,20.88 U$4.4
CH7_CBL
  Top 0.203: U$3.P$8A 18,8.07 18,11 24.5,17.5 24.5,19.75 24,20.25 22.68,20.25 U$4.3
CH8_CBL
  Top 0.203: U$3.P$21A 17.73,6.52 16.75,7.5 16.75,8.25 17.5,9 17.5,11.5 24,18 24,19 23.5,19.5 22.73,19.5 U$4.2
CH9_CBL
  Top 0.203: U$3.P$9A 16.5,9.74 16.5,13 14,15.5 14,19 14.5,19.5 15.27,19.5 | 15.27,19.5 U$4.23 15.27,19.5
CH10_CBL  (via drill 0.6)
  Top 0.203: v15.25,12.75 13.5,14.5 13.5,19.75 14,20.25 15.32,20.25 U$4.22 15.24,20.12
  Bottom 0.203: v15.25,12.75 15.25,9.25 16.25,8.25 16.25,6.11 U$3.P$22A
CH11_CBL
  Top 0.203: U$3.P$10A 15.5,8.11 15.5,11 13,13.5 13,20.38 13.5,20.88 U$4.21
CH12_CBL
  Top 0.203: U$3.P$23A 15.19,6.34 14.28,7.25 14.28,8.28 14.88,9 14.88,10.62 12.5,13 12.5,21 13,21.5 15.32,21.5 | 15.32,21.5 U$4.20 15.32,21.5
CH13_CBL
  Top 0.203: U$3.P$11A 13.92,10.42 12,12.5 12,21.62 12.5,22.12 15.29,22.12 | 15.29,22.12 U$4.19 15.29,22.12
CH14_CBL  (1 unrouted)
  Top 0.203: 13.92,5.85 13.67,6.1 13.67,8.33 13,9 13,10.5 11.5,12 11.5,22.25 12,22.75 15.27,22.75 U$4.18
CH15_CBL
  Top 0.203: U$3.P$12A 12.25,8.2 12.25,10.25 11,11.5 11,22.88 11.5,23.38 15.24,23.38 | 15.24,23.38 U$4.17 15.24,23.38
CH16_CBL
  Top 0.203: U$3.P$25A 11.5,4 10.5,5 10.5,23.62 11,24.12 U$4.16
DAC_VOUT  (via drill 0.6)
  Top 0.203: U$6.1 17.04,54.97 17.5,54.5 v17.5,53.5 | v31,48 33.5,48 35.5,50 JP1.1
  Bottom 0.203: v17.5,53.5 17.5,49 18.5,48 v31,48
DF_1
  Top 0.203: U$1.P$1 15.62,76.12 15.62,69.52 15.11,69 12,69 10.5,67.5 10.5,59.88 11,59.38 U$5.9
DF_2
  Top 0.203: U$1.P$20 17.2,68.58 15.62,67 14,67 12.5,65.51 12.5,62.5 13,62 15.32,62 U$5.5
DF_3
  Top 0.203: U$1.P$2 17.6,76.72 17.38,76.5 16.62,76.5 16,75.88 16,69.27 15.23,68.5 12.5,68.5 11,67 11,60.62 11.5,60.12 15.24,60.12 U$5.8
DF_4
  Top 0.203: 15.74,66.5 17.6,68.36 U$1.P$19 | 15.74,66.5 15.75,66.5 | 15.74,66.5 14.24,66.5 13,65.25 13,65 | 13,65 | 13,65 13,63.13 13.5,62.62 U$5.4
DF_5
  Top 0.203: U$1.P$3 18,76.38 17.75,76.12 16.88,76.12 16.38,75.62 16.38,69.01 15.36,68 13,68 11.5,66.5 11.5,61.25 12,60.75 15.27,60.75 U$5.7
DF_6
  Top 0.203: 15.87,66 18,68.13 U$1.P$18 | 15.87,66 15.88,66 | 15.87,66 14.5,66 13.5,65 13.5,63.88 14,63.38 15.24,63.38 U$5.3
DF_7  (1 unrouted)
  Top 0.203: U$1.P$4 18.4,76.15 18,75.75 17.12,75.75 16.75,75.38 16.75,68.76 15.5,67.51 | 15.5,67.51 15.5,67.5 | U$5.6 15.29,61.38 12.5,61.38 12,61.88 12,66 | 15.5,67.51 13.51,67.51 12,66
DF_8
  Top 0.203: U$1.P$17 18.4,67.9 16,65.5 14.75,65.5 14,64.75 14,64.25 14.25,64 15.27,64 U$5.2
DF_9
  Top 0.203: U$1.P$7 19.6,76.28 20.12,75.75 20.88,75.75 21.25,75.38 21.25,68.75 22.5,67.5 24.5,67.5 26,66 26,61.88 25.5,61.38 22.71,61.38 U$5.19
DF_10
  Top 0.203: U$1.P$14 19.6,67.9 22,65.5 23.5,65.5 24,65 24,64.38 23.5,63.88 22.71,63.88 U$5.23
DF_11
  Top 0.203: U$1.P$8 20,76.5 20.38,76.12 21.12,76.12 21.62,75.62 21.62,69 22.62,68 25,68 26.5,66.5 26.5,61.25 26,60.75 22.73,60.75 U$5.18
DF_12
  Top 0.203: U$5.22 22.68,63.25 24,63.25 24.5,63.75 24.5,65.12 23.62,66 22.13,66 20,68.13 U$1.P$13
DF_13
  Top 0.203: U$1.P$9 20.4,76.72 20.62,76.5 21.38,76.5 22,75.88 22,69.25 22.75,68.5 25.5,68.5 27,67 27,60.5 26.5,60 22.68,60 U$5.17
DF_14
  Top 0.203: U$1.P$12 20.4,68.36 22.26,66.5 23.75,66.5 25,65.25 25,63.12 24.5,62.62 U$5.21
DF_15
  Top 0.203: U$1.P$10 22.38,76.12 22.38,69.5 22.88,69 25.88,69 27.5,67.38 27.5,59.88 27,59.38 U$5.16
DF_16
  Top 0.203: U$5.20 22.68,62 25,62 25.5,62.5 25.5,65.5 24,67 22.38,67 20.8,68.58 U$1.P$11
DF_CH
  Top 0.203: U$6.9 14.23,49.77 14,50 14,55.75 14.5,56.25 17,56.25 17.5,56.75 17.5,64 16.93,64.58 U$5.1
DF_GND  (via drill 0.6)
  Top 0.203: U$1.P$6 U$1.P$5 19,77.7 v19,75.63 | v19.25,51.25 18.41,50.41 U$6.8
  Bottom 0.203: v19,75.63 17.36,75.63 16.58,74.86 16.58,73.67 19.25,71 v19.25,51.25
DF_REF
  Top 0.203: U$1.P$15 U$1.P$16 18.8,53.05 16.82,51.06 U$6.7
DOUT_3.3V
  Bottom 0.203: IC1.14 8.2,56.55 8.5,56.25 8.5,54.5 5,51 5,44.5 6,43.5 6,40 8.75,37.25 8.75,32.75 8.41,32.41 IC2.15
GND  (via drill 0.6)
  Top 0.203: v17,47.5 16.68,47.81 U$6.12 | U$5.12 14.5,57.42 v13,56 | U$4.15 14.22,24.77 v13,26 | U$5.15 27.77,58.73 v28.5,59.5 | U$6.15 U$6.14 U$6.13 22.62,47.12 v22,46.5 | v2,38.5 1.5,38 1.5,30 2,29.5 3.25,29.5 v3.5,29.75 | U$4.12 23.07,26.07 v24,27
  Bottom 0.203: IC2.8 1.81,38.31 v2,38.5 | v13,26 17.5,25.5
  pour Bottom: 0,70 0,59.5 7,59.5 7,31 0,31 0,0 38,0 38,70 23,70 23,77.5 22,78.5 16,78.5 15,77.5 15,70
MISO_3.3V  (via drill 0.6)
  Top 0.203: v4.25,50.5 v2,50.5
  Bottom 0.203: v4.25,50.5 4.5,50.25 4.5,43.5 5.5,42.5 5.5,39.5 8.27,36.73 8.27,33.38 7.94,33.05 IC2.14 | IC4.8 2.25,46.12 2.5,46.38 2.5,50 v2,50.5
MOSI_3.3V  (via drill 0.6)
  Top 0.203: v4.75,53.5 v2.75,53.5
  Bottom 0.203: IC1.15 5.91,55.91 4.75,54.75 v4.75,53.5 | v2.75,53.5 2.75,52.75 3,52.5 3,45.75 2.73,45.48 IC4.7
MP_4
  Top 0.203: U$4.10 25.27,24.77 26,25.5 26,43.5 26.74,44.24 JP4.7
MP_5
  Top 0.203: U$4.11 24.43,25.43 25,26 25,43.89 JP4.8
MP_6
  Top 0.203: U$4.14 16.43,25.43 18,27 22,27 23.5,28.5 23.5,44 26,46.5 26,47.43 JP4.9
MP_7
  Top 0.203: U$4.13 15.57,26.07 17.5,28 21.5,28 22.5,29 22.5,44.5 25,47 25,48.97 JP4.10
MP_8
  Top 0.203: U$5.13 24.86,57.42 JP4.11
MP_9
  Top 0.203: U$5.14 26.75,58.08 JP4.12
MP_10
  Top 0.203: U$5.11 11.24,58.08 JP3.12
MP_A0
  Top 0.203: U$5.10 9.72,58.73 8.5,57.5 8.5,48.39 JP3.8
MP_A1
  Top 0.203: U$6.10 13.62,49.12 12.5,48 12.5,45 11.74,44.24 JP3.7
MP_A2
  Top 0.203: U$6.11 13.96,48.47 13,47.5 13,43 11.7,41.7 JP3.6
MP_MISO_5V
  Bottom 0.203: IC4.13 6.38,46.12 6,46.5 6,49.5 8.25,51.75 10,51.75 JP3.10
MP_MOSI_5V
  Bottom 0.203: IC4.14 6.03,45.48 5.5,46 5.5,50 9.9,54.4 JP3.11
MP_SCL
  Top 0.203: JP2.8 JP4.6 28.2,41.7 29.5,43 29.5,56.01 JP1.4
MP_SCLK_5V
  Bottom 0.203: IC4.12 6.72,46.77 6.5,47 6.5,49 7,49.5 9.93,49.5 JP3.9
MP_SDA
  Bottom 0.203: JP2.7 JP4.5 28.16,39.16 32.5,43.5 32.5,56.47 JP1.3
MP_SS_5V
  Bottom 0.203: IC4.15 8.18,44.83 8.5,44.5 8.5,40.5 9.84,39.16 JP3.5
N$1  (via drill 0.6)
  Top 0.203: D9.C 4.25,41.75 v4.25,41
  Bottom 0.203: IC2.7 2.84,35.59 3,35.75 3,38.5 4.25,39.75 v4.25,41
N$2  (via drill 0.6)
  Top 0.203: D10.C 4.5,39 v4.5,38.5
  Bottom 0.203: IC2.6 2.95,34.95 3.38,35.38 3.38,37 4.5,38.12 v4.5,38.5
N$3  (via drill 0.6)
  Top 0.203: D11.C 4.25,35.75 v4.25,35.5
  Bottom 0.203: IC2.5 3.07,34.32 v4.25,35.5
N$4
  Bottom 0.203: U$7.15 17.85,19.75 R1.1 R2.2
N$5  (via drill 0.6)
  Top 0.203: D12.C 3.88,34 v3.75,33.88
  Bottom 0.203: IC2.4 3.56,33.68 v3.75,33.88
N$6  (via drill 0.6)
  Top 0.203: D13.C v3.75,32.75
  Bottom 0.203: IC2.3 3.45,33.05 v3.75,32.75
N$7  (via drill 0.6)
  Top 0.203: D14.C 4.5,28 v4,28.5
  Bottom 0.203: IC2.9 6.22,36.22 4.5,34.5 4.5,29 v4,28.5
N$8
  Bottom 0.203: U$7.3 12.25,20.25 11,19 C6.2
N$9  (via drill 0.6)
  Top 0.203: D5.C 5,55 v4,56
  Bottom 0.203: IC1.3 3.45,56.55 v4,56
N$10
  Bottom 0.203: U$7.2 12.25,19.75 12,19.5 12,18.5 13,17.5 R5.2
N$11  (via drill 0.6)
  Top 0.203: v4.5,62.5 5.5,61.5 D3.C
  Bottom 0.203: IC1.5 3.32,57.82 4,58.5 4,62 v4.5,62.5
N$12  (via drill 0.6)
  Top 0.203: D2.C v4,64
  Bottom 0.203: IC1.6 2.95,58.45 3.5,59 3.5,63.5 v4,64
N$13  (via drill 0.6)
  Top 0.203: D1.C v4,67
  Bottom 0.203: IC1.7 2.59,59.09 3,59.5 3,66 v4,67
N$14  (via drill 0.6)
  Top 0.203: D6.C 6.5,52 7,52.5 7,60 v8.5,61.5
  Bottom 0.203: IC1.9 7.19,60.19 v8.5,61.5
N$15  (via drill 0.6)
  Top 0.203: D7.C 7,49 7.5,49.5 7.5,59 v9,60.5
  Bottom 0.203: IC1.10 8.09,59.09 8.5,59.5 8.5,60 v9,60.5
N$16  (via drill 0.6)
  Top 0.203: D8.C 7.5,46 8,46.5 8,58 8.5,58.5 v9.5,59.5
  Bottom 0.203: IC1.11 8.45,58.45 v9.5,59.5
N$17
  Bottom 0.203: U$7.16 17,19.25 C7.1
N$18
  Bottom 0.203: U$7.4 12,20.75 11,19.75 10.75,19.75 10,19 R3.2 R4.1
N$19  (via drill 0.6)
  Top 0.203: D4.C 5.5,58.75 v4.75,59.5
  Bottom 0.203: IC1.4 4.18,57.18 4.75,57.75 v4.75,59.5
N$20
  Bottom 0.203: U$7.10 17.75,22.25 18,22.5 18,23.5 17.5,24 C3.1
N$21
  Bottom 0.203: C3.2 12.5,24 12,23.5 12,22.5 12.25,22.25 U$7.7
N$22
  Bottom 0.203: U$7.6 10.65,21.75 arc90 C5.1
N$23  (via drill 0.6)
  Top 0.203: D16.C 4.5,22 v4,22.5
  Bottom 0.203: IC2.11 6.2,34.95 5.25,34 5.25,23.5 4.25,22.5 v4,22.5
N$25  (via drill 0.6)
  Top 0.203: D18.C 4.5,15 v4,15.5
  Bottom 0.203: IC2.13 6.18,33.68 6,33.5 6,16.5 5,15.5 v4,15.5
N$27  (via drill 0.6)
  Top 0.203: D15.C 4.5,25 v4,25.5
  Bottom 0.203: IC2.10 6.21,35.59 4.88,34.25 4.88,26.38 v4,25.5
N$29  (via drill 0.6)
  Top 0.203: D17.C 4.5,18 v4,18.5
  Bottom 0.203: IC2.12 6.19,34.32 5.62,33.75 5.62,19.5 4.62,18.5 v4,18.5
SCK_3.3V
  Bottom 0.203: 2.22,55.28 IC1.1 0.58,54.05 0.58,47.13 0.94,46.77 | IC2.1 0.97,31.78 0.58,32.17 0.58,46.42 0.94,46.77 | 0.94,46.77 IC4.9
SS_3.3V  (via drill 0.6)
  Top 0.203: v1,29 1,44 1.5,44.5 v3.5,44.5
  Bottom 0.203: IC1.2 2.59,55.91 3.75,54.75 3.75,52.75 3.5,52.5 v3.5,44.5 3.17,44.83 IC4.6 | 2.67,44.83 IC4.6 | 2.83,44.83 IC4.6 | IC2.2 2.84,32.41 3.25,32 3.25,30.75 1.5,29 v1,29
VCC  (17 unrouted)
VNEG_CBL
  Bottom 0.203: JP5.3 35.51,9.25 35.5,7.5 34.5,6.5 SJ2.2 31.76,7.24 31,8 28.99,8 28.9,7.91 28.9,7.9 28,7 28,4 26.5,2.5 24.31,2.5 U$3.P$17A
VPOS_CBL
  Bottom 0.203: JP5.1 34.34,18.84 31.76,16.26 SJ1.2 31.76,9.76 31,9 28.5,9 26.62,7.12 U$3.P$14A

### Text on the board
tPlace: 1 | 2 | 3 | 4 | 5 | 6 | 7 | 8 | 9 | 10 | 11 | 12 | 13 | 14 | 15 | 16 | REF | GND
bPlace: +2.5V | -2.5V
tNames: 5V | MCP4725 / Adafruit ID: 935 | 10~ | ~9 | 8 | VOUT | 7 | ~6 | A0 | ~5 | 5V | A1 | 4 | A2 | SCL | A3 | SDA | VCC | GND | RST | GND | GND | RXI | RAW | TXO | A3 | +2.5V | GND | -2.5V
bNames: TDT 16 Ch Cable Tester v1.0 / David Bjanes / Moritz Lab c2017